# Altium schematic sheet AC_Input_Rectifier.SchDoc
size A4; SheetNumber: 2; SheetTotal: 8
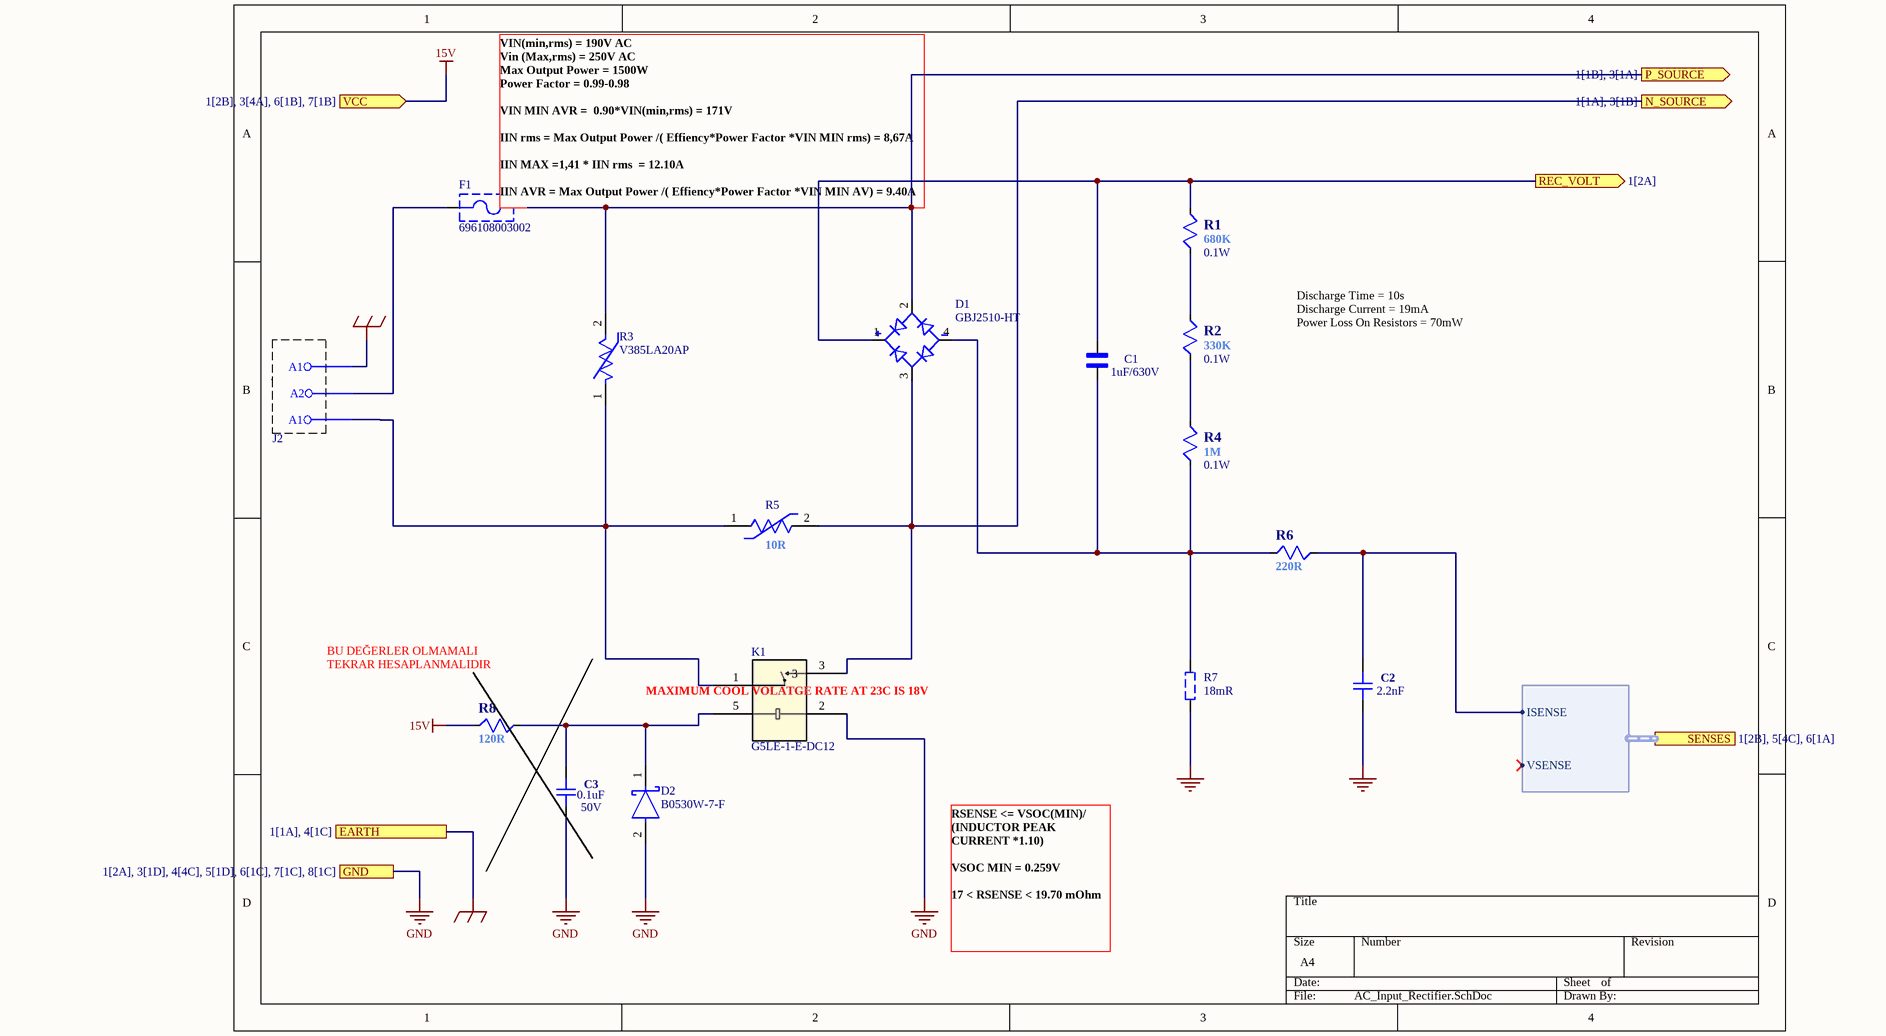
[diagram p0: AC_Input_Rectifier.SchDoc]

## Parts
C1  value 1uF/630V  [CAPRR3750W100L4150T1800H3250]  (hidden comment: B32026A3105M000)
C2  value 2.2nF  [CAPC1608N]  (hidden comment: CL10B222KB8NNNC)
C3  value 0.1uF  Rating: 50V  [CAPC1608N]  (hidden comment: CL10B104KB8NNNC)
D1  GBJ2510-HT  [DIOB_GBJ2510-F]
D2  B0530W-7-F  [FP-SOD123-MFG]
F1  696108003002  [696108003002]
J2  DG25S-B-03P-13-00AH  [DG28C-B-03P]  (value not drawn)
K1  G5LE-1-E-DC12  [G5LE-1-E-DC12]
R1  value 680K  Power Dissipation: 0.1W  [RESC1608N]  (hidden comment: CRT03F7E6803)
R2  value 330K  Power Dissipation: 0.1W  [RESC1608N]  (hidden comment: RC0603JR-07330KL)
R3  V385LA20AP  [FP-B72214S0301K101-0]
R4  value 1M  Power Dissipation: 0.1W  [RESC1608N]  (hidden comment: RI0603L105JT)
R5  Resistance: 10R  [FP-PGTL_P5_D7_4_T4_H13_4-MFG]  (hidden comment: PPL19100HA1B7CKB)
R6  value 220R  [RESC1608N]  (hidden comment: 0603SAF2200T5E)
R7  value 18mR  [CSS2H-2512]  (hidden comment: PE2512FKE7W0R018L)
R8  value 120R  [RESC1608N]  (hidden comment: CRT03J7E1200)

## Ports
EARTH (see 1[1A], 4[1C]), GND (see 1[2A], 3[1D], 4[4C], 5[1D], 6[1C], 7[1C], 8[1C]), N_SOURCE (out, see 1[1A], 3[1B]), P_SOURCE (out, see 1[1B], 3[1A]), REC_VOLT (out, see 1[2A]), SENSES (harness SENSES, see 1[2B], 5[4C], 6[1A]), VCC (in, see 1[2B], 3[4A], 6[1B], 7[1B])

## Harnesses
SENSES: ISENSE, VSENSE

## Nets
15V: R8.1 ; port VCC
EARTH: J2.3(A1) ; port EARTH
GND: C2.1 C3.1 D2.2(A) K1.2 R7.1 ; port GND
N_SOURCE: D1.3(AC2) K1.3 R5.2 ; port N_SOURCE
P_SOURCE: D1.2(AC1) F1.2 R3.2 ; port P_SOURCE
REC_VOLT: C1.2 D1.1(POS) R1.1 ; port REC_VOLT
NetC1_1: C1.1 D1.4(NEG) R4.2 R6.1 R7.2
NetC2_2: C2.2 R6.2 ; port SENSES.ISENSE
NetC3_2: C3.2 D2.1(C) K1.5 R8.2
NetF1_1: F1.1 J2.2(A2)
NetJ2_1: J2.1(A1) K1.1 R3.1 R5.1
NetR1_2: R1.2 R2.1
NetR2_2: R2.2 R4.1

## Notes on the sheet
- (near F1) VIN(min,rms) = 190V AC
  Vin (Max,rms) = 250V AC
  Max Output Power = 1500W
  Power Factor = 0.99-0.98
  VIN MIN AVR =  0.90*VIN(min,rms) = 171V
  IIN rms = Max Output Power /( Effiency*Power Factor *VIN MIN rms) = 8,67A
  IIN MAX =1,41 * IIN rms  = 12.10A
  IIN AVR = Max Output Power /( Effiency*Power Factor *VIN MIN AV) = 9.40A
- Discharge Time = 10s
  Discharge Current = 19mA
  Power Loss On Resistors = 70mW
- BU DEĞERLER OLMAMALI
- TEKRAR HESAPLANMALIDIR
- (near K1) MAXIMUM COOL VOLATGE RATE AT 23C IS 18V
- RSENSE <= VSOC(MIN)/ (INDUCTOR PEAK CURRENT *1.10)
  VSOC MIN = 0.259V
  17 < RSENSE < 19.70 mOhm

## Library data of the parts
C1 = B32026A3105M000: CAP, 1ÂµF, 20%, PP; Capacitance: 1ÂµF; Suppression Class: Y2; Product Range: B32026 Series; Voltage Rating X: -; Voltage Rating Y: 300V; Capacitor Dielectric Type: PP (Polypropylene); Capacitance Tolerance: Â± 20%; dv/dt Rating: 30; MF: TDK Electronics; SnapEDA_Link: https://www.snapeda.com/parts/B32026A3105M000/TDK/view-part/?ref=snap; Package: None; MP: B32026A3105M000; Check_prices: https://www.snapeda.com/parts/B32026A3105M000/TDK/view-part/?ref=eda
C2 = CAP_0805: MLCC (1608) 0603 2.2nF 50VDC ±10% X7R; Rating: 50V; Manufacturer: *; Manufacturer Part Number: *; Distributor Link: *; LCSC: *
C3 = CAP_0805: MLCC (1608) 0603 100nF 50VDC ±10% X7R; Manufacturer: *; Manufacturer Part Number: *; Distributor Link: *; LCSC: *
D1 = GBJ2510-HT: DIODE BRIDGE 25A 1000V; MF: Micro Commercial; MP: GBJ3510-BP; SnapEDA_Link: https://www.snapeda.com/parts/GBJ3510-BP/Micro%20Commercial/view-part/52240/?ref=snap; Availability: Warning; Purchase-URL: https://pricing.snapeda.com/search/part/GBJ3510-BP/?ref=eda; Check_prices: https://www.snapeda.com/parts/GBJ3510-BP/Micro%20Commercial/view-part/52240/?ref=eda; Value: *; Package: SIP-4 Micro Commercial; Price: None
D2 = CMP-2000-05879-2: DIODE SCHOTTKY 30V 500MA SOD123; Manufacturer: Diodes Inc.; Max Surge Forward Current: 5.5A; Forward Current: 0.5A; Max Junction Temp: +125°C; Standoff Height: 0mm; Capacitance: 170pF; Value: 170pF; Peak Reverse Current: 130uA; Footprint Url: https://www.diodes.com/assets/Package-Files/SOD123.pdf; Device Class L1: Discrete Semiconductors; ComponentLink2Description: Datasheet; Mouser Description: Schottky Diodes & Rectifiers 30V 410mW; Device Class L3: Schottky Diodes; Package: SOD123; Temperature: -65°C to +125°C; Temperature Range Low: -65°C; Lead Free: Yes; Digikey Description: DIODE SCHOTTKY 30V 500MA SOD123; Ipc Land Pattern Name: SOD365155X123-2; Automotive: No; Octopart: https://octopart.com/b0530w-7-f-diodes+inc.-325721; Device Class L2: Diodes; ComponentLink2URL: https://www.diodes.com/assets/Datasheets/ds30139.pdf; RoHS: TRUE; Height: 1.45mm; Max Repetitive Reverse Voltage: 30V; Category: Diode; Temperature Range High: +125°C; Manufacturer Part Number: B0530W-7-F; Reverse Voltage: 30V
F1 = CMP-1502-00237-2: FUSE HOLDER 5x20 TK79 PLASTIC; NexarPartId: 56808807; Voltage Rating (AC): 250V; Fuse Current: 10A; REACH SVHC: Unknown; RoHS: Non-Compliant; Mount: Through Hole; Packaging: Box
J2 = DG25S-B-03P-13-00AH: TERM.BLK.7.62MM 3P BARRIER TERMINAL BLACK
K1 = G5LE-1-E-DC12: RELAY POWER 16A 12V 1FormC 5PIN; Manufacturer_Name: Omron; Copyright: Copyright (C) 2025 Ultra Librarian. All rights reserved.; Manufacturer_Part_Number: G5LE-1-E-DC12; RefDes: RefDes; Type: Type
R1 = RES: RES.(1608) 0603 680K Ohms 1% 1/10W 100PPM,
R2 = RES: RES.(1608) 0603 330K Ohms 5% 1/10W 100PPM SMT,
R3 = CMP-10618-000016-1: VARISTOR 470V 4.5KA DISC 14MM; Energy: 76J; Clamping Voltage: 775V; Voltage Rating (AC): 300V; Lead Length: 30mm; Capacitance: 300pF; Lead/Base Style: Radial; Tolerance: 10%; Clamping Current: 50A; Max Voltage Rating (DC): 385V; Packaging: Bulk; Min Operating Temperature: -40°C; Max Operating Temperature: 85°C; Depth: 5.2mm; Lead Pitch: 7.5mm; Max Surge Current: 4.5kA; Package Quantity: 500; RoHS Compliant: Yes; Max Voltage Rating (AC): 300V; Mount: Radial; Varistor Voltage: 470V; REACH SVHC: No SVHC; Thickness: 5.2mm; Series: StandardD; Diameter: 14mm; Weight: 0.141096oz; Voltage Tolerance: 10%; Voltage Rating (DC): 385V
R4 = RES: RES.(1608) 0603 1M Ohms 5% 1/10W 200PPM,
R5 = CMP-06022-000524-1: THERMISTOR PTC 10R 270VAC
R6 = RES: RES.(1608) 0603 220 Ohms 1% 1/10W-S 100PPM
R7 = CSS2H-2512: 18 mOhms ±1% 2W Chip Resistor 2512 (6332 Metric) Automotive AEC-Q200, Current Sense Metal Film; Manufacturer: YAGEO; Manufacturer Part Number: PE2512FKE7W0R018L
R8 = RES: RES.(1608) 0603 120 Ohms 5% 1/10W-S 100PPM